# EAGLE design power electronicsV5.1 (EAGLE 9.6.2)

## Sheet 1 of 2
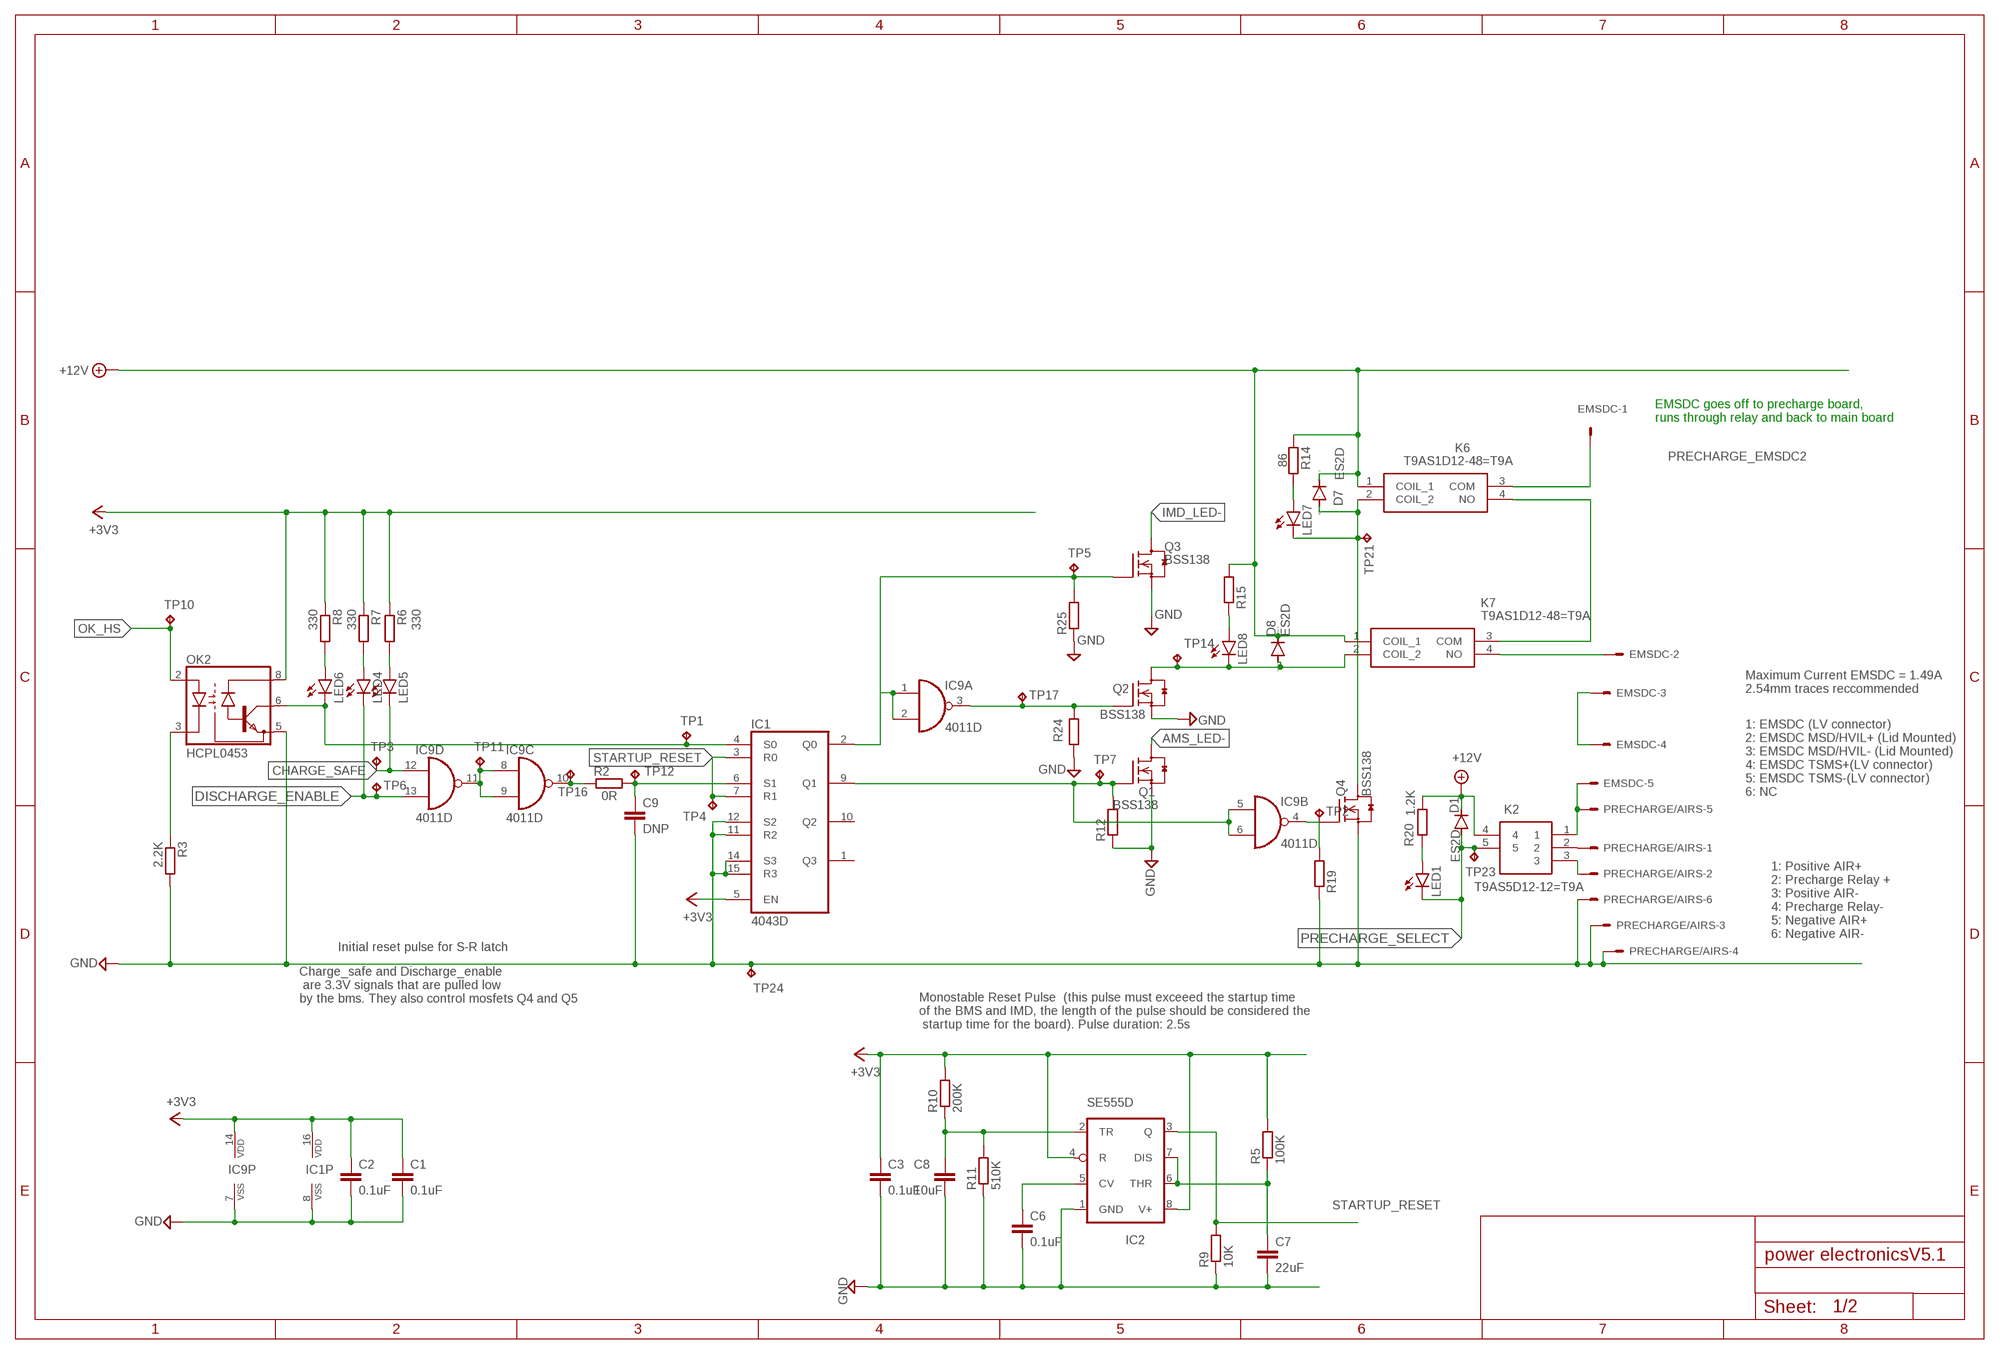
[diagram p0: schematic, sheet 1]

### Parts
C1  0.1uF  C-EUC0805  [C0805]
C2  0.1uF  C-EUC0805  [C0805]
C3  0.1uF  C-EUC0805  [C0805]
C6  0.1uF  C-EUC0805  [C0805]
C7  22uF  C-EUC1206  [C1206]
C8  10uF  C-EUC0805  [C0805]
C9  DNP  C-EUC0805K  [C0805K]
D1  ES2D  [SMB]
D7  ES2D  [SMB]
D8  ES2D  [SMB]
EMSDC  KK-156-6  [KK-156-6]
IC1  4043D  [SO16]
IC2  SE555D  [SO08]
IC9  4011D  [SO14]
K2  T9AS5D12-12=T9A  [T9AS1D12]
K6  T9AS1D12-48=T9A  [T9AS1D1248T9A]
K7  T9AS1D12-48=T9A  [T9AS1D1248T9A]
LED1  LEDSML0805  [SML0805]
LED4  LEDSML0805  [SML0805]
LED5  LEDSML0805  [SML0805]
LED6  LEDSML0805  [SML0805]
LED7  LEDSML0805  [SML0805]
LED8  LEDSML0805  [SML0805]
OK2  HCPL0453  [SOIC08]
PRECHARGE/AIRS  KK-156-6  [KK-156-6]
Q1  BSS138  [SOT23]
Q2  BSS138  [SOT23]
Q3  BSS138  [SOT23]
Q4  BSS138  [SOT23]
R2  0R  R-EU_R0805  [R0805]
R3  2.2K  R-EU_R0805  [R0805]
R5  100K  R-EU_R0805  [R0805]
R6  330  R-EU_R0805  [R0805]
R7  330  R-EU_R0805  [R0805]
R8  330  R-EU_R0805  [R0805]
R9  10K  R-EU_R0805  [R0805]
R10  200K  R-EU_R0805  [R0805]
R11  510K  R-EU_R0805  [R0805]
R12  R-EU_R0805  [R0805]
R14  R-EU_R0805  [R0805]
R15  R-EU_R0805  [R0805]
R19  R-EU_R0805  [R0805]
R20  1.2K  R-EU_R0805  [R0805]
R24  R-EU_R0805  [R0805]
R25  R-EU_R0805  [R0805]
TP1  TPPAD1-17  [P1-17]
TP2  TPPAD1-17  [P1-17]
TP3  TPPAD1-17  [P1-17]
TP4  TPPAD1-17  [P1-17]
TP5  TPPAD1-17  [P1-17]
TP6  TPPAD1-17  [P1-17]
TP7  TPPAD1-17  [P1-17]
TP10  TPPAD1-17  [P1-17]
TP11  TPPAD1-17  [P1-17]
TP12  TPPAD1-17  [P1-17]
TP14  TPPAD1-17  [P1-17]
TP16  TPPAD1-17  [P1-17]
TP17  TPPAD1-17  [P1-17]
TP21  TPPAD1-17  [P1-17]
TP23  TPPAD1-17  [P1-17]
TP24  TPPAD1-17  [P1-17]

### Nets
+3V3: C1.1 C2.1 C3.1 IC1.5(EN) IC1.16(VDD) IC2.4(R) IC2.8(V+) IC9.14(P:VDD) OK2.8(VCC) R5.2 R6.1 R7.1 R8.1 R10.2
+12V [power]: D1.C D7.C D8.C K2.4 K6.1(COIL_1) K7.1(COIL_1) R14.2 R15.2 R20.1 ; also sheet 2
AMS_LED-: Q1.3(D) ; also sheet 2
CHARGE_SAFE: IC9.12(D:I0) LED5.C TP3.TP ; also sheet 2
DISCHARGE_ENABLE: IC1.9(Q1) IC9.5(B:I0) IC9.6(B:I1) IC9.13(D:I1) LED4.C Q1.1(G) R12.2 TP6.TP TP7.TP ; also sheet 2
GND [GND]: C1.2 C2.2 C3.2 C6.2 C7.2 C8.2 C9.2 IC1.8(VSS) IC1.11(R2) IC1.12(S2) IC1.14(S3) IC1.15(R3) IC2.1(GND) IC9.7(P:VSS) OK2.5(GND) PRECHARGE/AIRS.3 PRECHARGE/AIRS.4 PRECHARGE/AIRS.6 Q1.2(S) Q2.2(S) Q3.2(S) Q4.2(S) R3.2 R9.1 R11.1 R12.1 R19.1 R24.1 R25.1 TP24.TP ; also sheet 2
IMD_COIL_OUT: D8.A K7.2(COIL_2) LED8.C Q2.3(D) TP14.TP
IMD_LED-: Q3.3(D) ; also sheet 2
N$1: IC9.10(C:O) R2.1 TP16.TP
N$3 [EMSDC]: K2.2 PRECHARGE/AIRS.1
N$5: IC1.4(S0) LED6.C OK2.6(VO) TP1.TP
N$6: IC9.8(C:I0) IC9.9(C:I1) IC9.11(D:O) TP11.TP
N$7: OK2.3(C) R3.1
N$8: IC9.3(A:O) Q2.1(G) R24.2 TP17.TP
N$9: IC1.2(Q0) IC9.1(A:I0) IC9.2(A:I1) Q3.1(G) R25.2 TP5.TP
N$10: C9.1 IC1.6(S1) R2.2 TP12.TP
N$11 [EMSDC]: EMSDC.5 K2.1 PRECHARGE/AIRS.5
N$12 [EMSDC]: K2.3 PRECHARGE/AIRS.2
N$14: EMSDC.2 K7.4(NO)
N$15 [GND]: D7.A K6.2(COIL_2) LED7.C Q4.3(D) TP21.TP
N$16: IC9.4(B:O) Q4.1(G) R19.2 TP2.TP
N$17: C7.1 IC2.6(THR) IC2.7(DIS) R5.1
N$18: LED7.A R14.1
N$19 [EMSDC]: EMSDC.3 EMSDC.4
N$20: LED8.A R15.1
N$21 [GND]: K6.4(NO) K7.3(COM)
N$22: LED1.A R20.2
N$25: LED4.A R7.2
N$26: LED5.A R6.2
N$27: LED6.A R8.2
N$28: C8.1 IC2.2(TR) R10.1 R11.2
N$32: C6.1 IC2.5(CV)
OK_HS: OK2.2(A) TP10.TP ; also sheet 2
PRECHARGE_EMSDC2: EMSDC.1 K6.3(COM)
PRECHARGE_SELECT: D1.A K2.5 LED1.C TP23.TP ; also sheet 2
STARTUP_RESET: IC1.3(R0) IC1.7(R1) IC2.3(Q) R9.2 TP4.TP
Unconnected: EMSDC.6 IC1.1(Q3) IC1.10(Q2)

### Notes on the sheet
- EMSDC goes off to precharge board, 
  runs through relay and back to main board
- Maximum Current EMSDC = 1.49A
  2.54mm traces reccommended
- 1: EMSDC (LV connector)
  2: EMSDC MSD/HVIL+ (Lid Mounted)
  3: EMSDC MSD/HVIL- (Lid Mounted)
  4: EMSDC TSMS+(LV connector)
  5: EMSDC TSMS-(LV connector)
  6: NC
- 1: Positive AIR+
  2: Precharge Relay +
  3: Positive AIR-
  4: Precharge Relay-
  5: Negative AIR+
  6: Negative AIR-
- Initial reset pulse for S-R latch
- Charge_safe and Discharge_enable
   are 3.3V signals that are pulled low 
  by the bms. They also control mosfets Q4 and Q5
- Monostable Reset Pulse  (this pulse must exceeed the startup time 
  of the BMS and IMD, the length of the pulse should be considered the
   startup time for the board). Pulse duration: 2.5s

## Sheet 2 of 2
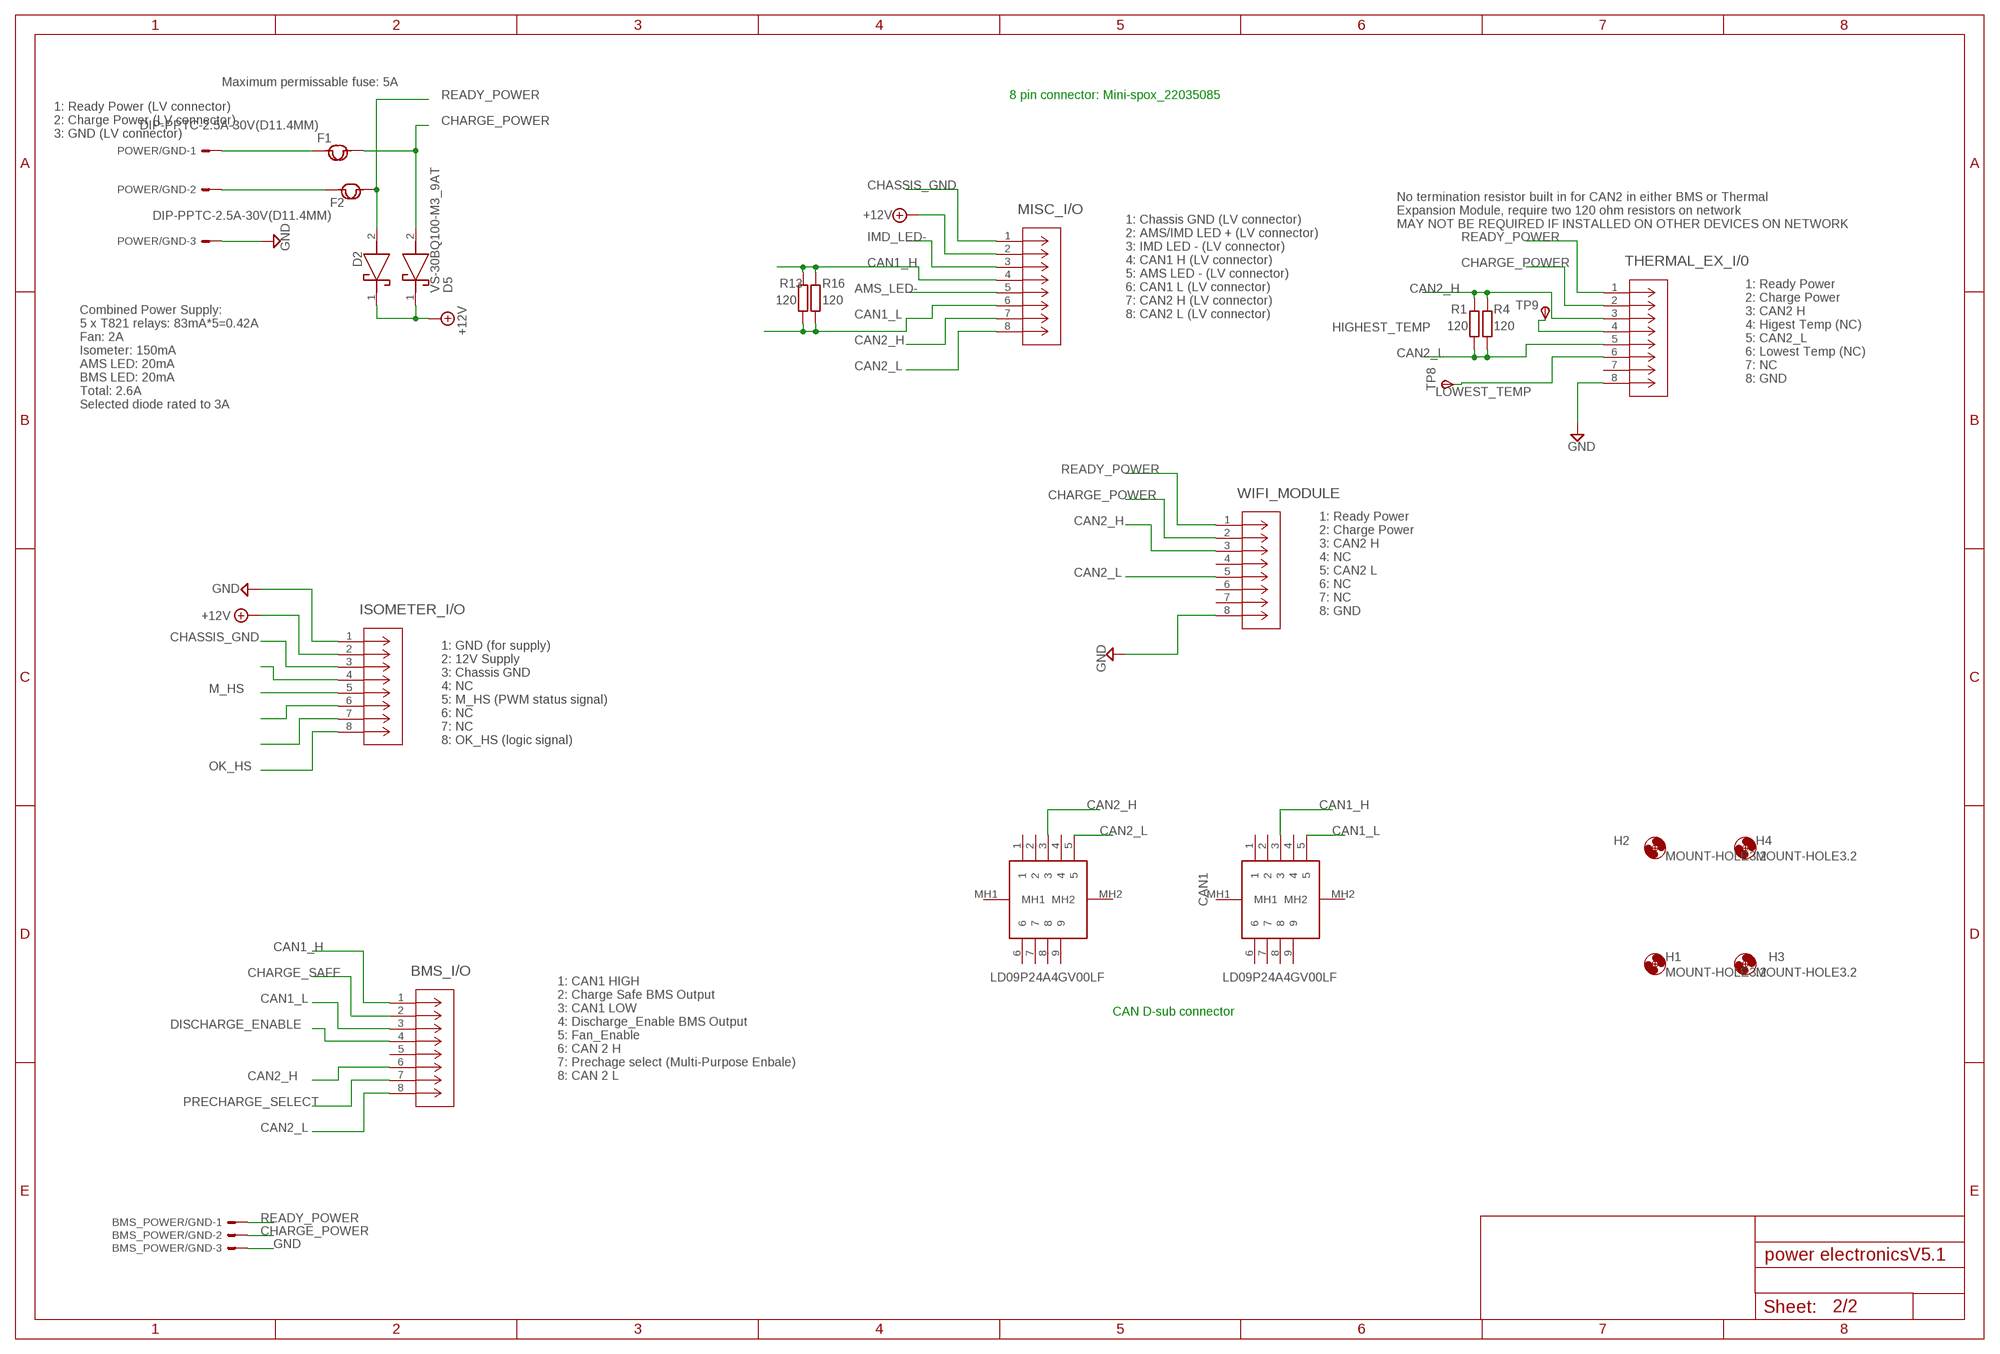
[diagram p1: schematic, sheet 2]

### Parts
BMS_I/O  MINI-SPOX_22035085  [CON_22035085_MOL]
BMS_POWER/GND  KK-156-3  [KK-156-3]
CAN1  LD09P24A4GV00LF  [LD09P24A4GV00LF]
CAN2  LD09P24A4GV00LF  [LD09P24A4GV00LF]
D2  VS-30BQ100-M3_9AT  [DIOM7959X262N]
D5  VS-30BQ100-M3_9AT  [DIOM7959X262N]
F1  DIP-PPTC-2.5A-30V(D11.4MM)  [F2-5.1-11.4X3.0X18.3MM]
F2  DIP-PPTC-2.5A-30V(D11.4MM)  [F2-5.1-11.4X3.0X18.3MM]
H1  MOUNT-HOLE3.2  [3,2]
H2  MOUNT-HOLE3.2  [3,2]
H3  MOUNT-HOLE3.2  [3,2]
H4  MOUNT-HOLE3.2  [3,2]
ISOMETER_I/O  MINI-SPOX_22035085  [CON_22035085_MOL]
MISC_I/O  MINI-SPOX_22035085  [CON_22035085_MOL]
POWER/GND  KK-156-3  [KK-156-3]
R1  120  R-EU_R1206  [R1206]
R4  120  R-EU_R1206  [R1206]
R13  120  R-EU_R1206  [R1206]
R16  120  R-EU_R1206  [R1206]
THERMAL_EX_I/0  MINI-SPOX_22035085  [CON_22035085_MOL]
TP8  TPSTP11R  [TP11R]
TP9  TPSTP11R  [TP11R]
WIFI_MODULE  MINI-SPOX_22035085  [CON_22035085_MOL]

### Nets
+12V [power]: D2.1(K) D5.1(K) ISOMETER_I/O.2 MISC_I/O.2 ; also sheet 1
AMS_LED-: MISC_I/O.5 ; also sheet 1
CAN1_H: BMS_I/O.1 CAN1.3 MISC_I/O.4 R13.1 R16.1
CAN1_L: BMS_I/O.3 CAN1.5 MISC_I/O.6 R13.2 R16.2
CAN2_H: BMS_I/O.6 CAN2.3 MISC_I/O.7 R1.1 R4.1 THERMAL_EX_I/0.3 WIFI_MODULE.3
CAN2_L: BMS_I/O.8 CAN2.5 MISC_I/O.8 R1.2 R4.2 THERMAL_EX_I/0.5 WIFI_MODULE.5
CHARGE_POWER [power]: BMS_POWER/GND.2 D5.2(A) F1.1 THERMAL_EX_I/0.2 WIFI_MODULE.2
CHARGE_SAFE: BMS_I/O.2 ; also sheet 1
CHASSIS_GND [GND]: ISOMETER_I/O.3 MISC_I/O.1
DISCHARGE_ENABLE: BMS_I/O.4 ; also sheet 1
GND [GND]: BMS_POWER/GND.3 ISOMETER_I/O.1 POWER/GND.3 THERMAL_EX_I/0.8 WIFI_MODULE.8 ; also sheet 1
HIGHEST_TEMP: THERMAL_EX_I/0.4 TP9.TP(PP)
IMD_LED-: MISC_I/O.3 ; also sheet 1
LOWEST_TEMP: THERMAL_EX_I/0.6 TP8.TP(PP)
M_HS: ISOMETER_I/O.5
N$2 [power]: F2.2 POWER/GND.2
N$4 [power]: F1.2 POWER/GND.1
N$46: ISOMETER_I/O.4
N$51: ISOMETER_I/O.7
N$52: ISOMETER_I/O.6
OK_HS: ISOMETER_I/O.8 ; also sheet 1
PRECHARGE_SELECT: BMS_I/O.7 ; also sheet 1
READY_POWER [power]: BMS_POWER/GND.1 D2.2(A) F2.1 THERMAL_EX_I/0.1 WIFI_MODULE.1
Unconnected: BMS_I/O.5 CAN1.1 CAN1.2 CAN1.4 CAN1.6 CAN1.7 CAN1.8 CAN1.9 CAN1.MH1 CAN1.MH2 CAN2.1 CAN2.2 CAN2.4 CAN2.6 CAN2.7 CAN2.8 CAN2.9 CAN2.MH1 CAN2.MH2 THERMAL_EX_I/0.7 WIFI_MODULE.4 WIFI_MODULE.6 WIFI_MODULE.7

### Notes on the sheet
- Maximum permissable fuse: 5A
- 8 pin connector: Mini-spox_22035085
- 1: Ready Power (LV connector)
  2: Charge Power (LV connector)
  3: GND (LV connector)
- No termination resistor built in for CAN2 in either BMS or Thermal
  Expansion Module, require two 120 ohm resistors on network
  MAY NOT BE REQUIRED IF INSTALLED ON OTHER DEVICES ON NETWORK
- 1: Chassis GND (LV connector)
  2: AMS/IMD LED + (LV connector)
  3: IMD LED - (LV connector)
  4: CAN1 H (LV connector)
  5: AMS LED - (LV connector)
  6: CAN1 L (LV connector)
  7: CAN2 H (LV connector)
  8: CAN2 L (LV connector)
- 1: Ready Power
  2: Charge Power
  3: CAN2 H
  4: Higest Temp (NC)
  5: CAN2_L
  6: Lowest Temp (NC)
  7: NC
  8: GND
- Combined Power Supply:
  5 x T821 relays: 83mA*5=0.42A
  Fan: 2A
  Isometer: 150mA
  AMS LED: 20mA
  BMS LED: 20mA
  Total: 2.6A
  Selected diode rated to 3A
- 1: Ready Power
  2: Charge Power
  3: CAN2 H
  4: NC
  5: CAN2 L
  6: NC
  7: NC
  8: GND
- 1: GND (for supply) 
  2: 12V Supply
  3: Chassis GND 
  4: NC 
  5: M_HS (PWM status signal)
  6: NC
  7: NC
  8: OK_HS (logic signal)
- CAN D-sub connector
- 1: CAN1 HIGH
  2: Charge Safe BMS Output 
  3: CAN1 LOW
  4: Discharge_Enable BMS Output
  5: Fan_Enable
  6: CAN 2 H
  7: Prechage select (Multi-Purpose Enbale)
  8: CAN 2 L

## Library data of the parts
BMS_I/O ISOMETER_I/O MISC_I/O THERMAL_EX_I/0 WIFI_MODULE = Mini-spox_22035085:MINI-SPOX_22035085; COPYRIGHT: Copyright (C) 2023 Ultra Librarian. All rights reserved.; MANUFACTURER_PART_NUMBER: 22035085; MFR_NAME: Molex Connector Corporation
BMS_POWER/GND POWER/GND = con-molex:KK-156-3: KK 156 HEADER Source: http://www.molex.com/pdm_docs/sd/026604100_sd.pdf; MF: MOLEX; OC_FARNELL: unknown; OC_NEWARK: unknown
C1-C3 C6-C9 = rcl:C-EU: CAPACITOR, European symbol; SPICEPREFIX: C
CAN1 CAN2 = LD09P24A4GV00LF:LD09P24A4GV00LF: Amphenol FCI LD Series, 9 Way Plug-In Mount D-sub Connector Plug, 2.74mm Pitch, with Screw Source: Datasheet <https://www.mouser.com/datasheet/2/18/10130912-1362365.pdf>; ARROW_PART_NUMBER: LD09P24A4GV00LF; ARROW_PRICE-STOCK: https://www.arrow.com/en/products/ld09p24a4gv00lf/amphenol-fci?region=nac; DESCRIPTION: Amphenol FCI LD Series, 9 Way Plug-In Mount D-sub Connector Plug, 2.74mm Pitch, with Screw; HEIGHT: 12.15mm; MANUFACTURER_NAME: Amphenol Communication Solutions; MANUFACTURER_PART_NUMBER: LD09P24A4GV00LF; MOUSER_PART_NUMBER: 649-LD09P24A4GV00LF; MOUSER_PRICE-STOCK: https://www.mouser.co.uk/ProductDetail/Amphenol-FCI/LD09P24A4GV00LF?qs=tZOhSuJQg1nfkziarphghA%3D%3D
D1 D7 D8 = diode:ES2D: DIODE super fast rectifier, 2 A
D2 D5 = SamacSys_Parts:VS-30BQ100-M3_9AT: Vishay VS-30BQ100-M3/9AT SMT Schottky Diode, 100V 3A, 2-Pin DO-214AB Source: Datasheet <https://componentsearchengine.com/Datasheets/1/VS-30BQ100-M3_9AT.pdf>; DESCRIPTION: Vishay VS-30BQ100-M3/9AT SMT Schottky Diode, 100V 3A, 2-Pin DO-214AB; HEIGHT: 2.62mm; MANUFACTURER_NAME: Vishay; MANUFACTURER_PART_NUMBER: VS-30BQ100-M3/9AT; MOUSER_PART_NUMBER: 78-VS-30BQ100-M39AT; MOUSER_PRICE-STOCK: https://www.mouser.com/Search/Refine.aspx?Keyword=78-VS-30BQ100-M39AT
EMSDC PRECHARGE/AIRS = con-molex:KK-156-6: KK 156 HEADER Source: http://www.molex.com/pdm_docs/sd/026604100_sd.pdf; MF: MOLEX; OC_FARNELL: unknown; OC_NEWARK: unknown
F1 F2 = DIP-PPTC-2.5A-30V_D11.4MM_:DIP-PPTC-2.5A-30V(D11.4MM): 307010009 Check availability <https://pricing.snapeda.com/parts/30R250/Littelfuse/view-part?ref=eda>; AVAILABILITY: In Stock; DESCRIPTION: Polymeric PTC Resettable Fuse 30V 2.5A Ih Through Hole Radial, Disc; MF: Littelfuse; MP: 30R250; PACKAGE: Radial Littelfuse Inc.; PRICE: None
H1-H4 = holes:MOUNT-HOLE: MOUNTING HOLE with drill center marker
IC1 = 40xx:4043: Quad 3-state NOR R/S LATCH
IC2 = linear:*555: TIMER
IC9 = 40xx:4011: Quad 2-input NAND
K2 = SamacSys_Parts:T9AS5D12-12=T9A: PCB Relay SPDT 30A 12Vdc,thru hole SPDT PCB Mount Non-Latching Relay Through Hole, 12V dc Source: Datasheet; ALLIED_NUMBER: R1111589; DESCRIPTION: PCB Relay SPDT 30A 12Vdc,thru hole SPDT PCB Mount Non-Latching Relay Through Hole, 12V dc; HEIGHT: mm; MANUFACTURER_NAME: TE Connectivity; MANUFACTURER_PART_NUMBER: T9AS5D12-12=T9A; RS_PART_NUMBER: 6802528; RS_PRICE-STOCK: https://uk.rs-online.com/web/p/products/6802528
K6 K7 = T9AS1D12-12=T9A:T9AS1D12-48=T9A: SPST-NO PCB Mount Non-Latching Relay Through Hole, 48V dc Source: Datasheet <https://www.te.com/commerce/DocumentDelivery/DDEController?Action=showdoc&DocId=Data Sheet1308242_T9A0915pdfEnglishENG_DS_1308242_T9A_0915.pdf1-1393210-9>; DESCRIPTION: SPST-NO PCB Mount Non-Latching Relay Through Hole, 48V dc; HEIGHT: 20.4mm; MANUFACTURER_NAME: TE Connectivity; MANUFACTURER_PART_NUMBER: T9AS1D12-48=T9A
LED1 LED4-LED8 = led:LED: LED OSRAM: - CHIPLED LG R971, LG N971, LY N971, LG Q971, LY Q971, LO R971, LY R971 LH N974, LH R974 LS Q976, LO Q976, LY Q976 LO Q996 - Hyper CHIPLED LW Q18S LB Q993, LB Q99A, LB R99A - SideLED LS A670, LO A670, LY A670, LG A670, LP A670 LB A673, LV A673, LT A673, LW A673 LH A674 LY A675 LS A676, LA A676, LO A676, LY A676, LW A676 LS A679, LY A679, LG A679 - Hyper Micro SIDELED® LS Y876, LA Y876, LO Y876, LY Y876 LT Y87S - SmartLED LW L88C, LW L88S LB L89C, LB L89S, LG L890 LS L89K, LO L89K, LY L89K LS L896, LA L896, LO L896, LY L896 - TOPLED LS T670, LO T670, LY T670, LG T670, LP T670 LSG T670, LSP T670, LSY T670, LOP T670, LYG T670 LG T671, LOG T671, LSG T671 LB T673, LV T673, LT T673, LW T673 LH T674 LS T676, LA T676, LO T676, LY T676, LB T676, LH T676, LSB T676, LW T676 LB T67C, LV T67C, LT T67C, LS T67K, LO T67K, LY T67K, LW E67C LS E67B, LA E67B, LO E67B, LY E67B, LB E67C, LV E67C, LT E67C LW T67C LS T679, LY T679, LG T679 LS T770, LO T770, LY T770, LG T770, LP T770 LB T773, LV T773, LT T773, LW T773 LH T774 LS E675, LA E675, LY E675, LS T675 LS T776, LA T776, LO T776, LY T776, LB T776 LHGB T686 LT T68C, LB T68C - Hyper Mini TOPLED® LB M676 - Mini TOPLED Santana® LG M470 LS M47K, LO M47K, LY M47K Source: http://www.osram.convergy.de LUXEON: - LUMILED® LXK2-PW12-R00, LXK2-PW12-S00, LXK2-PW14-U00, LXK2-PW14-V00 LXK2-PM12-R00, LXK2-PM12-S00, LXK2-PM14-U00 LXK2-PE12-Q00, LXK2-PE12-R00, LXK2-PE12-S00, LXK2-PE14-T00, LXK2-PE14-U00 LXK2-PB12-K00, LXK2-PB12-L00, LXK2-PB12-M00, LXK2-PB14-N00, LXK2-PB14-P00, LXK2-PB14-Q00 LXK2-PR12-L00, LXK2-PR12-M00, LXK2-PR14-Q00, LXK2-PR14-R00 LXK2-PD12-Q00, LXK2-PD12-R00, LXK2-PD12-S00 LXK2-PH12-R00, LXK2-PH12-S00 LXK2-PL12-P00, LXK2-PL12-Q00, LXK2-PL12-R00 Source: www.luxeon.com KINGBRIGHT: KA-3528ASYC Source: www.kingbright.com
OK2 = optocoupler:HCPL0453: HEWLETT PACKARD OPTO COUPLER; MF: AGILENT TECHNOLOGIES; MPN: HCPL-0453-000E; OC_FARNELL: 1505123; OC_NEWARK: 88H7766
Q1-Q4 = m-pad-2.1:BSS138: Fairchild Semiconductors BSS138 N-Channel Logic Level Enhancement Mode Field Effect Transistor General Description: These N-Channel enhancement mode field effect transistors are produced using Fairchild's proprietary, high cell density, DMOS technology. These products have been designed to minimize on-state resistance while provide rugged, reliable, and fast switching performance.These products are particularly suited for low voltage, low current applications such as small servo motor control, power MOSFET gate drivers, and other switching applications. Features: 0.22 A, 50 V. RDS(ON) = 3.5Ohm @ VGS = 10 V RDS(ON) = 6.0Ohm @ VGS = 4.5 V High density cell design for extremely low RDS(ON) Rugged and Reliable Compact industry standard SOT-23 surface mount package Please send any comments to: messi@users.sourceforge.net
R1-R16 R19 R20 R24 R25 = rcl:R-EU_: RESISTOR, European symbol; SPICEPREFIX: R
TP1-TP7 TP10-TP12 TP14 TP16 TP17 TP21 TP23 TP24 = testpad:TP: Test pad
TP8 TP9 = testpad:TPS: TEST PIN

## Net classes
0 default: width 0.508 mm
1 GND: width 0.889 mm
2 EMSDC: width 2.54 mm
3 power: width 0.889 mm

## Board
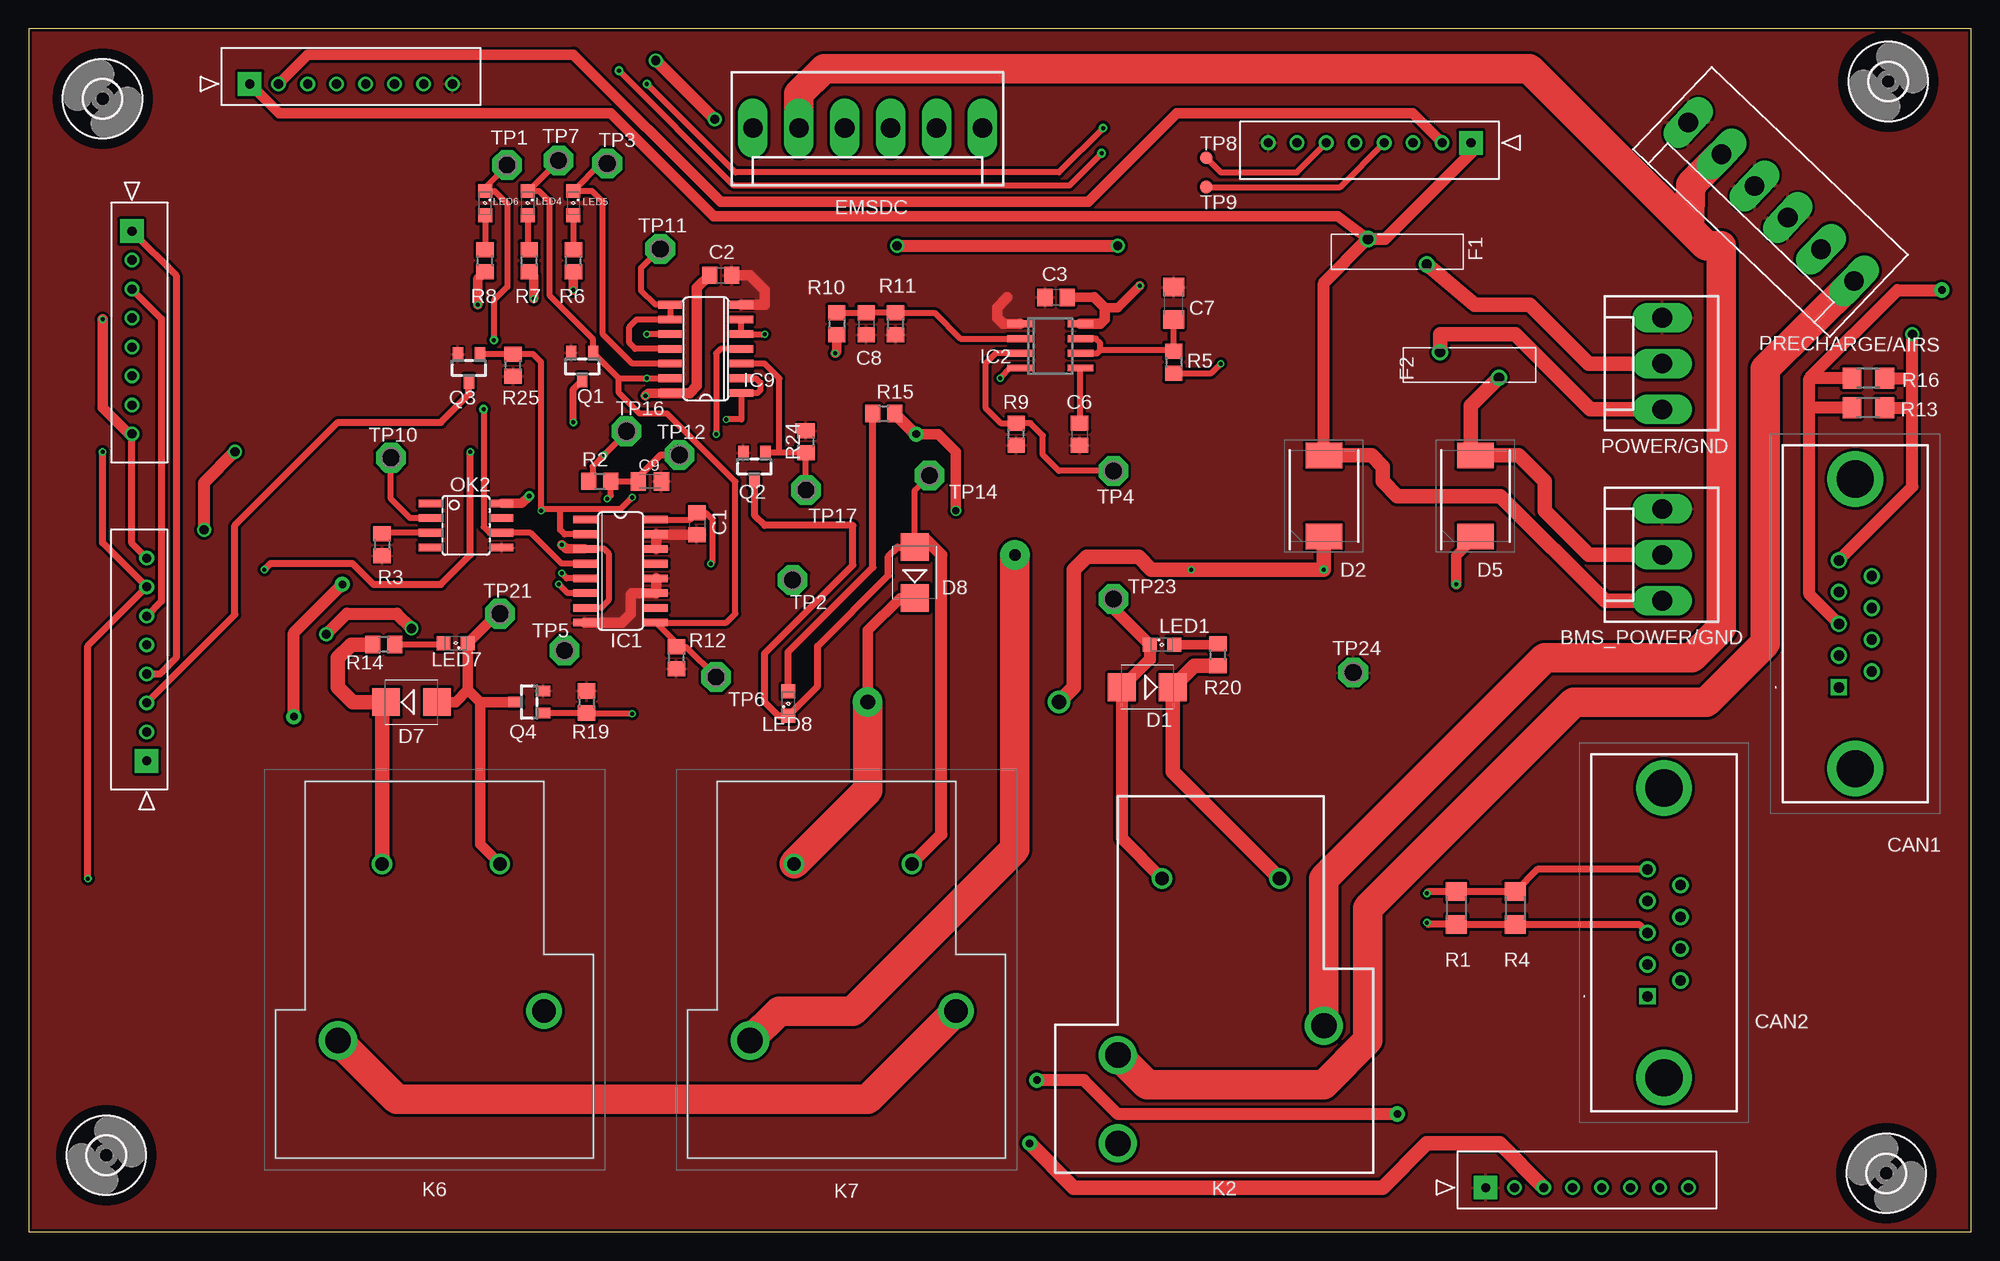
[diagram p2: board, top side]
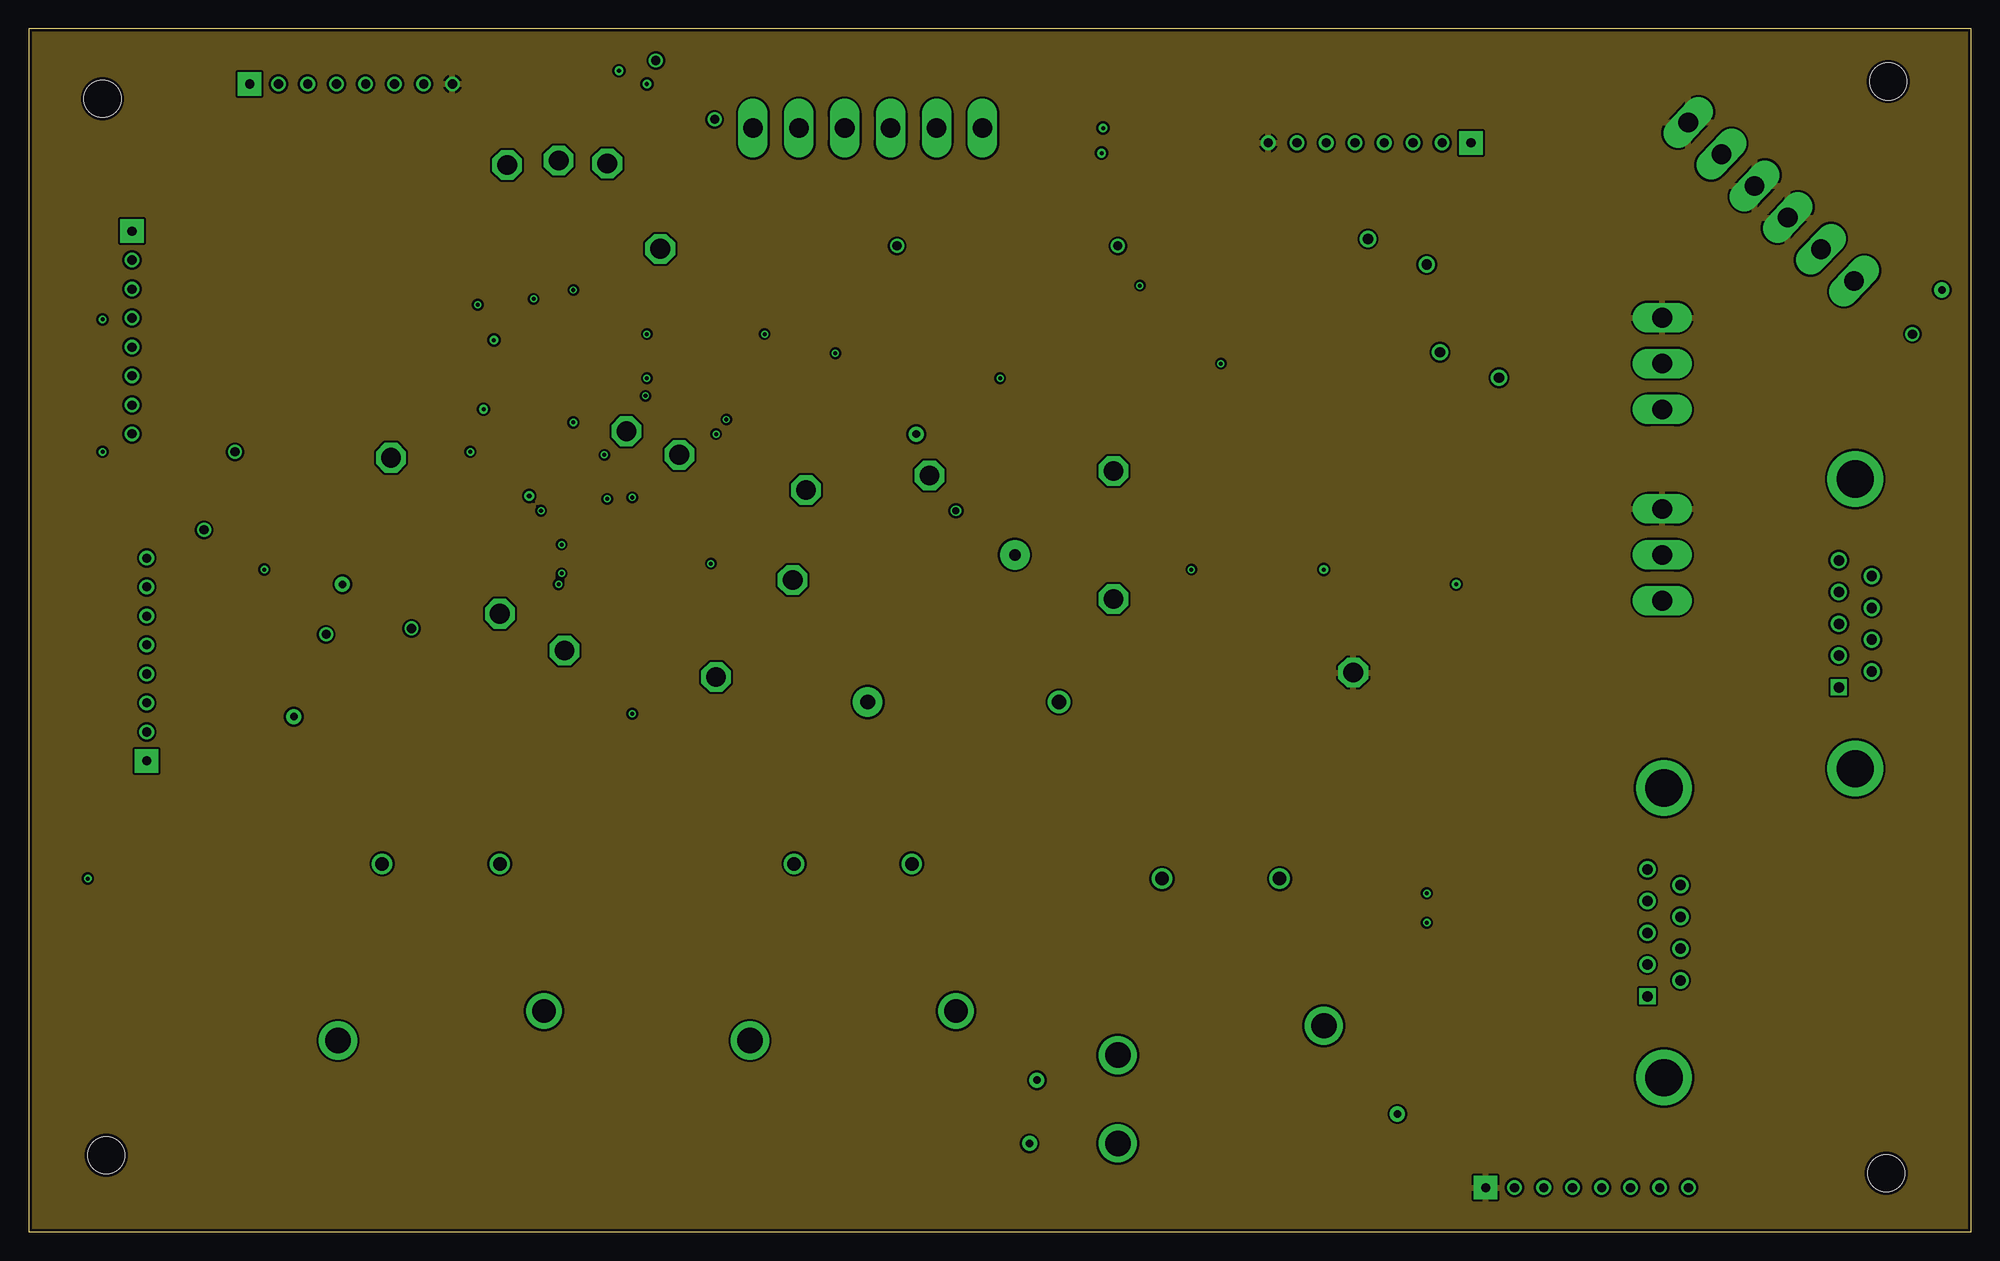
[diagram p3: board, inner layer Route2]
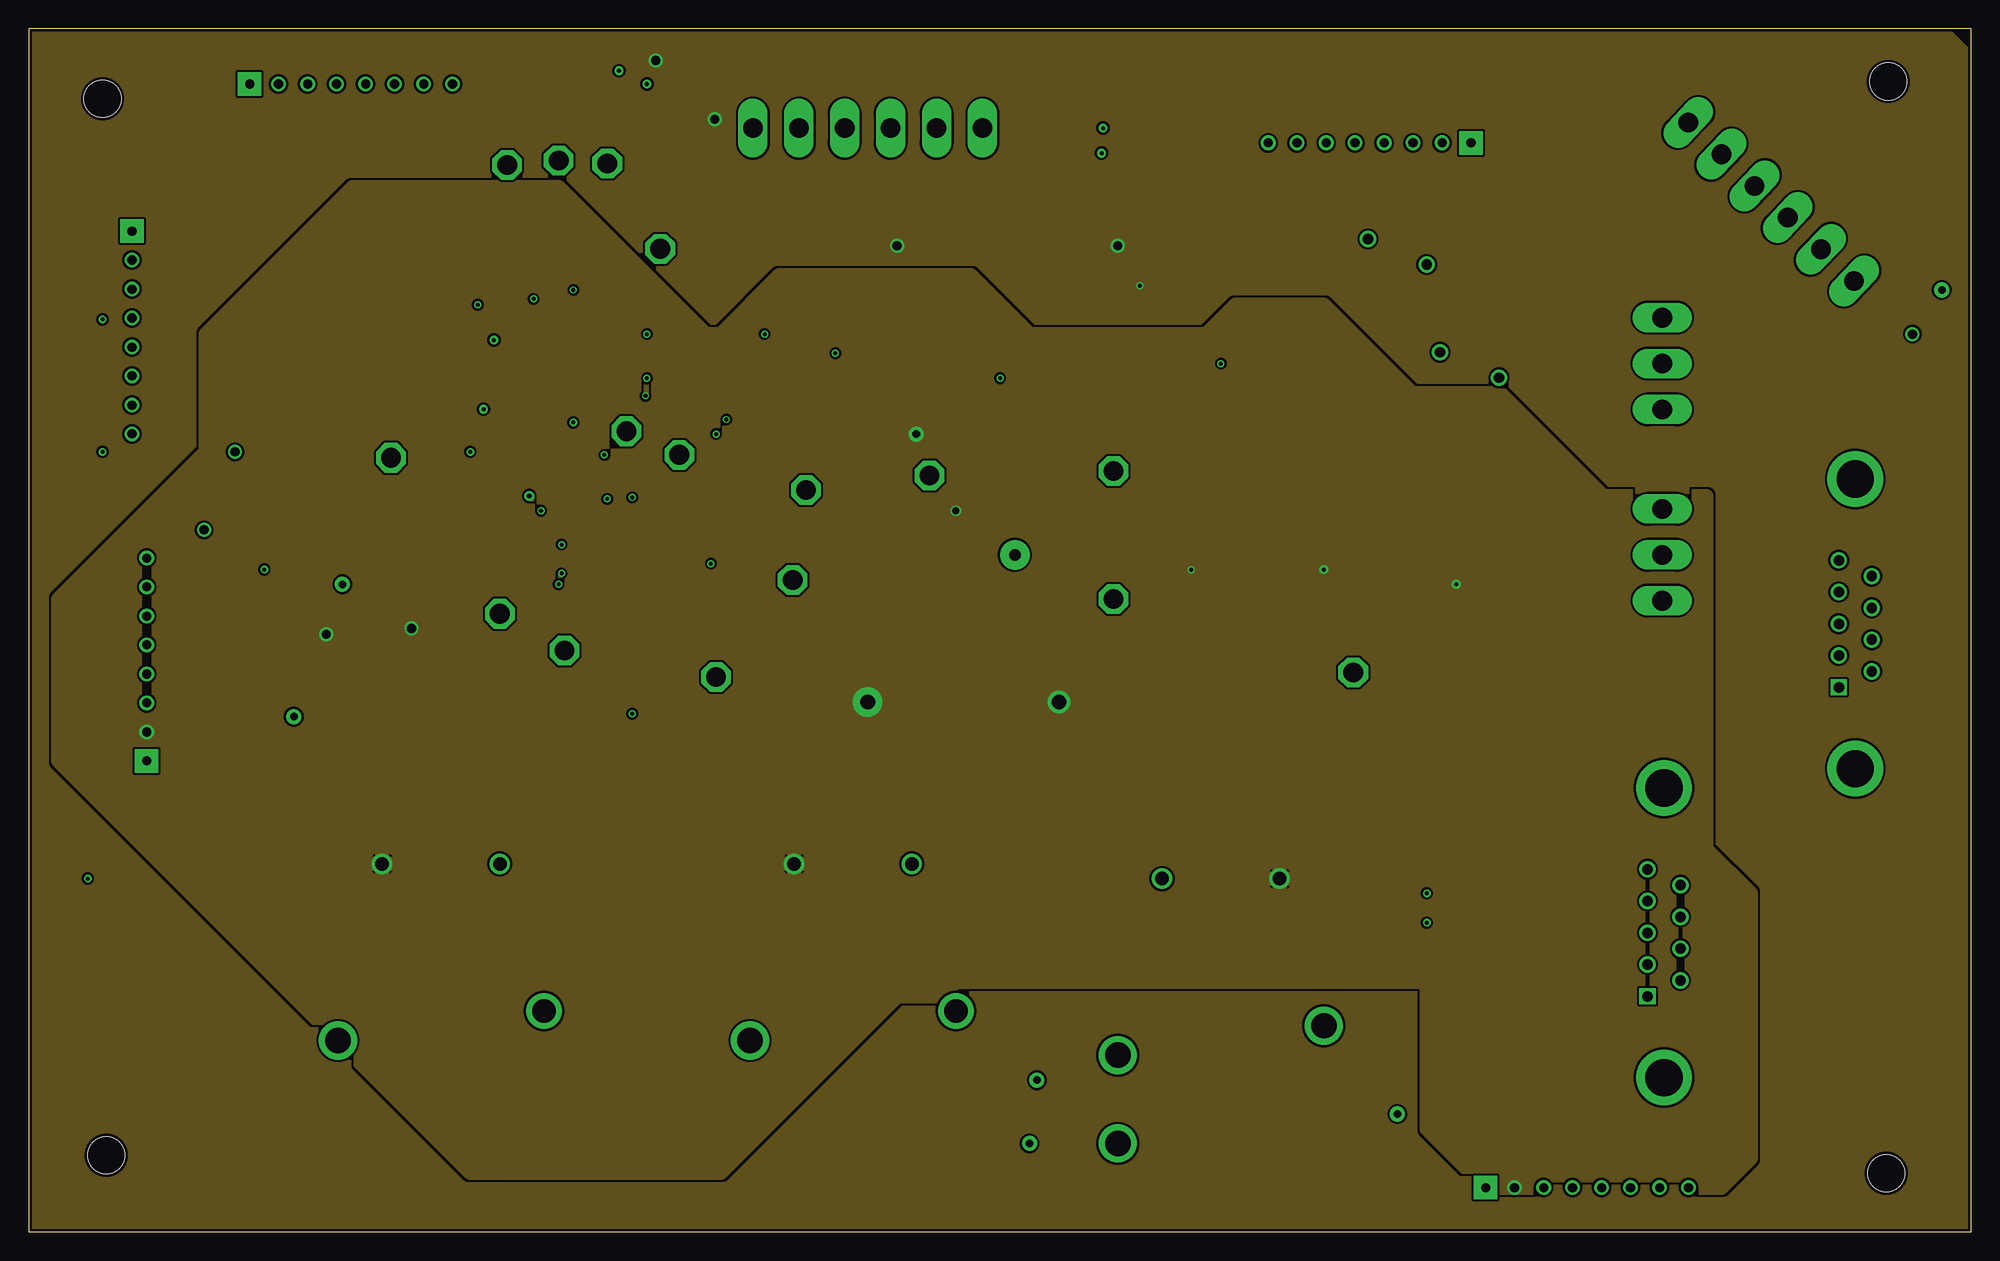
[diagram p4: board, inner layer Route15]
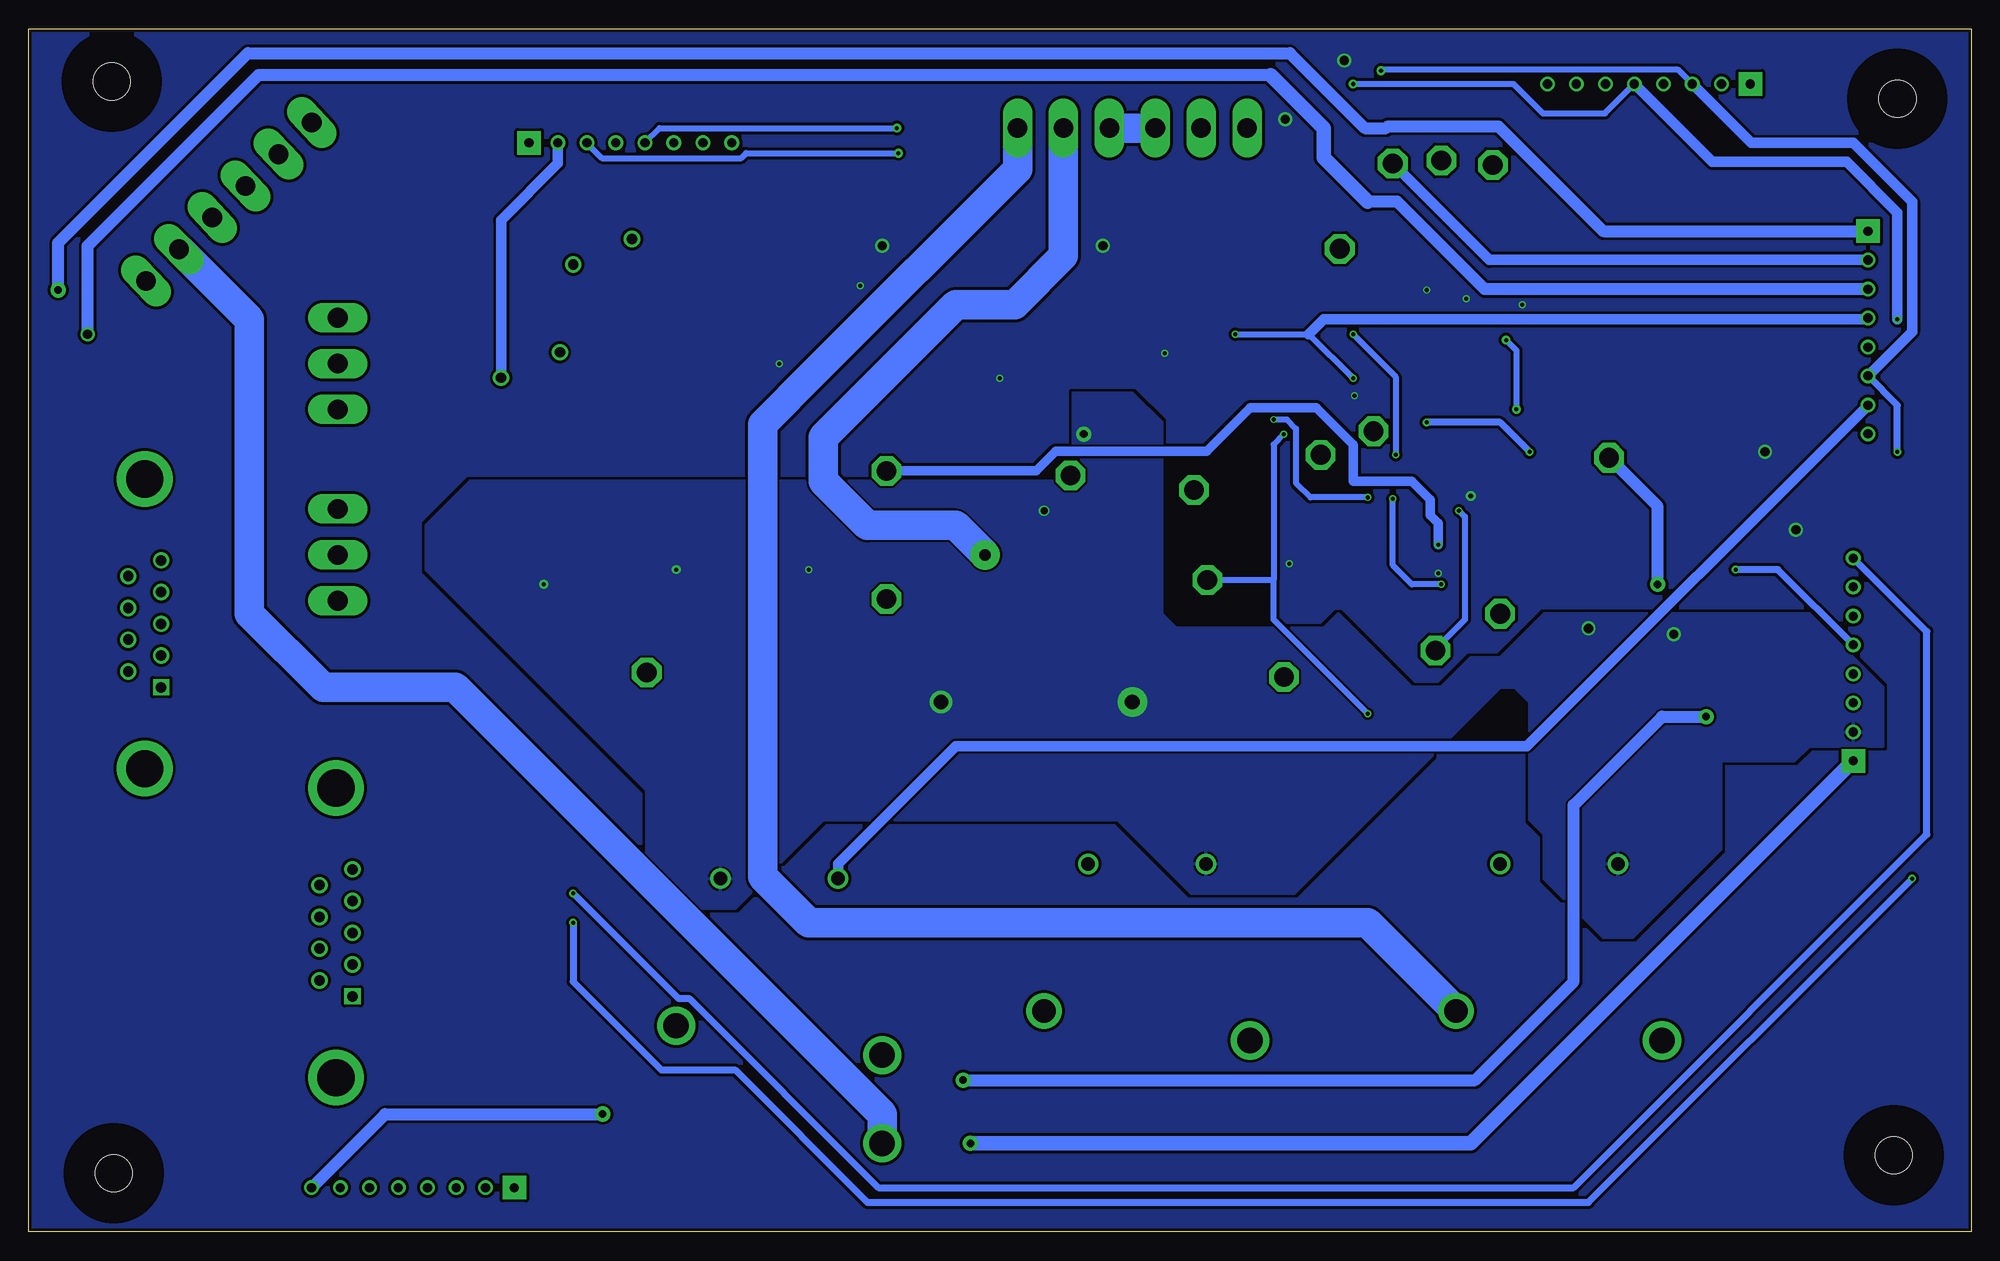
[diagram p5: board, bottom side, seen from below]

Size 167.62 x 103.81 mm. Coordinates in mm from the lower left corner, seen from the top.
Outline: 0,0 167.62,0 167.62,103.81 0,103.81 0,0
Copper layers (1*16): Top 0.018mm / dielectric 1.55mm / Bottom 0.018mm
Design rules "eC_2Layer_PClass6_BaseCopperO18_eCDefault *": minimum track width 0.15mm, minimum drill 0.35mm, track to track 0.2mm, track to pad 0.2mm, pad to pad 0.2mm, via to via 0.2mm, smd to smd 0mil, copper to edge 0.25mm, drill to drill 0.35mm, minimum pad ring 0.175mm, minimum via ring 0.125mm, stop-mask expansion 0mil, vias tented up to drill 0.45mm, thermal gap 0.2mm

### Footprints (pad centres in the part's own frame; a part is rotated, then mirrored left to right if it is on the bottom)
CON_22035085_MOL = drill 0.787 pad 2.032 square: 1 0,0 | drill 0.787 pad 1.27: 2 -2.489,0; 3 -5.004,0; 4 -7.493,0; 5 -10.008,0; 6 -12.497,0; 7 -15.011,0; 8 -17.501,0
KK-156-3 = drill 1.7 pad 2.184 long: 1 -3.96,0; 2 0,0; 3 3.96,0
C0805 = smd 1.3 x 1.5: 1 -0.95,0; 2 0.95,0
C1206 = smd 1.6 x 1.8: 1 -1.4,0; 2 1.4,0
C0805K = smd 1.3 x 1.6: 1 -1,0; 2 1,0
LD09P24A4GV00LF = drill 0.9 pad 1.4 square: 1 0,0 | drill 0.9 pad 1.4: 2 2.74,0; 3 5.48,0; 4 8.22,0; 5 10.96,0; 6 1.37,-2.84; 7 4.11,-2.84; 8 6.85,-2.84; 9 9.59,-2.84 | drill 3.2 pad 4.8: MH1 -7.015,-1.42; MH2 17.975,-1.42
SMB = smd 2.4 x 2.4: A 2.2,0; C -2.2,0
DIOM7959X262N = smd 2.2 x 3.15: 1 -3.5,0; 2 3.5,0
KK-156-6 = drill 1.7 pad 2.184 long: 1 -9.9,0; 2 -5.94,0; 3 -1.98,0; 4 1.98,0; 5 5.94,0; 6 9.9,0
F2-5.1-11.4X3.0X18.3MM = drill 0.889 pad 1.397: 1 -2.54,1.1; 2 2.54,-1.1
3,2 = hole 3.2: 0,0
SO16 = smd 0.66 x 2.032: 1 -4.445,-3.073; 2 -3.175,-3.073; 3 -1.905,-3.073; 4 -0.635,-3.073; 5 0.635,-3.073; 6 1.905,-3.073; 7 3.175,-3.073; 8 4.445,-3.073; 9 4.445,3.073; 10 3.175,3.073; 11 1.905,3.073; 12 0.635,3.073; 13 -0.635,3.073; 14 -1.905,3.073; 15 -3.175,3.073; 16 -4.445,3.073
SO08 = smd 0.6 x 2.2: 1 -1.905,-2.6; 2 -0.635,-2.6; 3 0.635,-2.6; 4 1.905,-2.6; 5 1.905,2.6; 6 0.635,2.6; 7 -0.635,2.6; 8 -1.905,2.6
SO14 = smd 0.66 x 2.032: 1 -3.81,-3.073; 2 -2.54,-3.073; 3 -1.27,-3.073; 4 0,-3.073; 5 1.27,-3.073; 6 2.54,-3.073; 7 3.81,-3.073; 8 3.81,3.073; 9 2.54,3.073; 10 1.27,3.073; 11 0,3.073; 12 -1.27,3.073; 13 -2.54,3.073; 14 -3.81,3.073
T9AS1D12 = drill 2.19 pad 3.29: 1 -8.89,12.7; 2 8.89,15.24; 3 8.89,22.86 | drill 1.17 pad 1.77: 4 -5.08,0; 5 5.08,0
T9AS1D1248T9A = drill 1.17 pad 1.755: 1 0,0; 2 -10.16,0 | drill 2.06 pad 3.09: 3 -13.97,12.7 | drill 2.19 pad 3.3: 4 3.81,15.24
SML0805 = smd 1.2 x 1.2: A 1.05,0; C -1.05,0
SOIC08 = smd 0.66 x 2.032: 1 -1.905,-3.073; 2 -0.635,-3.073; 3 0.635,-3.073; 4 1.905,-3.073; 5 1.905,3.073; 6 0.635,3.073; 7 -0.635,3.073; 8 -1.905,3.073
SOT23 = smd 0.9 x 1.2: 1 -0.95,-1.2; 2 0.95,-1.2; 3 0,1.2
R1206 = smd 1.6 x 1.803: 1 -1.422,0; 2 1.422,0
R0805 = smd 1.3 x 1.5: 1 -0.95,0; 2 0.95,0
P1-17 = drill 1.702 pad 2.54 octagon: TP 0,0
TP11R = smd 1.1 x 1.1: TP 0,0

### Placement (x,y rotation side)
BMS_I/O  8.89,86.36 90 top
BMS_POWER/GND  140.97,58.42 90 top
C1  57.66,61.09 270 top
C2  59.69,82.55 0 top
C3  88.65,80.64 180 top
C6  90.68,68.83 270 top
C7  98.81,80.14 90 top
C8  72.26,78.36 270 top
C9  53.59,64.77 0 top
CAN1  156.21,46.99 90 top
CAN2  139.7,20.32 90 top
D1  96.52,46.99 180 top
D2  111.76,63.5 90 top
D5  124.84,63.5 90 top
D7  33.02,45.72 0 top
D8  76.45,56.9 90 top
EMSDC  72.39,95.25 180 top
F1  124.33,74.8 180 top
F2  118.11,84.58 0 top
H1  6.35,97.79 90 top
H2  6.68,6.6 0 top
H3  160.48,99.28 0 top
H4  160.3,5.04 90 top
IC1  51.05,57.02 270 top
IC2  88.14,76.45 270 top
IC9  58.42,76.2 90 top
ISOMETER_I/O  125.73,3.81 180 top
K2  102.87,30.48 180 top
K6  30.48,31.75 180 top
K7  66.04,31.75 180 top
LED1  97.79,50.67 0 top
LED4  43.05,88.77 270 top
LED5  46.99,88.77 270 top
LED6  39.37,88.77 270 top
LED7  36.83,50.8 180 top
LED8  65.53,45.59 90 top
MISC_I/O  10.16,40.64 270 top
OK2  37.72,60.96 270 top
POWER/GND  140.97,74.93 90 top
PRECHARGE/AIRS  150.37,88.9 136.3 top
Q1  47.75,74.68 180 top
Q2  62.61,66.04 180 top
Q3  37.97,74.55 180 top
Q4  43.18,45.72 90 top
R1  123.19,27.94 90 top
R2  49.28,64.77 0 top
R3  30.48,59.31 270 top
R4  128.27,27.94 90 top
R5  98.81,75.06 270 top
R6  46.99,83.82 90 top
R7  43.18,83.82 90 top
R8  39.37,83.82 90 top
R9  85.22,68.83 90 top
R10  69.72,78.36 270 top
R11  74.8,78.36 90 top
R12  55.88,49.53 90 top
R13  158.75,71.12 0 top
R14  30.61,50.67 180 top
R15  73.79,70.61 0 top
R16  158.75,73.66 0 top
R19  48.13,45.72 270 top
R20  102.62,49.78 90 top
R24  67.06,68.2 270 top
R25  41.78,74.8 90 top
THERMAL_EX_I/0  124.46,93.98 0 top
TP1  41.27,92.08 0 top
TP2  65.91,56.26 0 top
TP3  49.91,92.2 0 top
TP4  93.6,65.66 0 top
TP5  46.23,50.16 0 top
TP6  59.31,47.88 0 top
TP7  45.72,92.46 0 top
TP8  101.6,92.71 0 top
TP9  101.6,90.17 0 top
TP10  31.24,66.8 0 top
TP11  54.48,84.84 0 top
TP12  56.13,67.06 0 top
TP14  77.72,65.28 0 top
TP16  51.56,69.09 0 top
TP17  67.06,64.01 0 top
TP21  40.64,53.34 0 top
TP23  93.6,54.61 0 top
TP24  114.3,48.26 0 top
WIFI_MODULE  19.05,99.06 180 top

### Tracks (layer width: path | path; a pad name or v marks a point on that pad's centre or on a via)
+3V3  (via drill 0.35, 0.35 pad 0.6, 0.4 pad 0.85, 0.8)
  Top 0.508: IC1.16 57.09,61.47 C1.1 58.42,62.04 58.98,61.47 58.98,57.78 v58.86,57.66 | IC1.5 46.41,56.39 v45.97,56.83 | R5.2 102.05,74.11 v102.87,74.93 | IC2.4 84.71,74.55 v83.82,73.66
  Top 0.813: IC9.14 54.61,72.39 53.47,72.39 v53.21,72.14 | R6.1 v46.99,81.28 | R7.1 43.56,82.49 v43.56,80.52 | R8.1 38.73,82.23 v38.73,80.01 | R10.2 69.72,75.95 v69.6,75.82 | OK2.8 42.55,62.87 v43.18,63.5 | 92.84,79.76 93.98,79.76 v95.89,81.66 | C3.1 91.95,80.64
  Top 0.889: C2.1 57.66,81.47 57.66,73.03 57.02,72.39 54.61,72.39 | IC2.8 92.46,78.36 92.84,78.74 92.84,79.76 91.95,80.64
  Top 1.016: v15.11,60.58 15.11,64.64 v17.78,67.31 | v74.93,85.09 v93.98,85.09 | v59.18,96.01 v54.1,101.09
  pour Route15 (rank 2): 0,104.14 165.1,104.14 167.64,101.6 167.64,0 1.27,0 0,-1.27
  pour Bottom (isolate 0.254, rank 4): 0.05,104.14 0.05,-1.27 170.18,-1.27 170.18,104.14
+12V  (via drill 0.35, 0.35 pad 0.75, 0.6, 0.65 pad 1.3, 0.8, 1.27, 1.27 pad 2.54)
  Top 0.889: D5.1 123.19,58.35 v123.19,55.88 | v76.58,68.83 78.49,68.83 80.01,67.31 v80.01,62.23 | v72.39,45.72 72.39,51.9 75.18,54.7 D8.C
  Top 1.016: R15.2 76.52,68.83 v76.58,68.83 | v25.65,51.56 27.43,53.34 31.75,53.34 v33.02,52.07
  Top 1.27: R20.1 100.56,48.83 D1.C 98.72,39.71 K2.4 | K6.1 30.48,45.38 D7.C 27.94,45.72 26.67,46.99 26.67,49.53 27.81,50.67 R14.2 | D2.1 v111.76,57.15 v100.33,57.15 96.88,57.15 95.77,58.26 91.28,58.26 90.17,57.15 90.17,46.99 v88.9,45.72
  Top 2.54: K7.1 72.39,38.1 v72.39,45.72
  pour Route15: 59.69,5.08 38.1,5.08 2.54,40.64 2.54,54.61 15.24,67.31 15.24,77.47 27.94,90.17 45.72,90.17 58.42,77.47 59.69,77.47 64.77,82.55 81.28,82.55 86.36,77.47 101.6,77.47 104.14,80.01 111.76,80.01 119.38,72.39 127,72.39 135.89,63.5 144.78,63.5 144.78,33.02 148.59,29.21 148.59,6.35 146.05,3.81 125.73,3.81 120.65,8.89 120.65,21.59 80.01,21.59 78.74,20.32 74.93,20.32
  pour Bottom: 21.59,40.64 21.59,33.02 29.21,25.4 31.75,25.4 36.83,30.48 36.83,34.29 38.1,35.56 38.1,45.72 39.37,46.99 40.64,46.99 58.42,29.21 67.31,29.21 73.66,35.56 99.06,35.56 106.68,27.94 110.49,27.94 114.3,31.75 114.3,38.1 133.35,57.15 133.35,60.96 129.54,64.77 78.74,64.77 77.47,66.04 77.47,72.39 72.39,72.39 69.85,69.85 69.85,53.34 68.58,52.07 55.88,52.07 54.61,53.34 48.26,46.99 45.72,46.99 43.18,49.53 40.64,49.53 36.83,53.34 13.97,53.34 7.62,46.99 7.62,41.91 13.97,41.91 15.24,40.64
AMS_LED-  (via drill 0.35 pad 0.65)
  Top 0.61: v20.32,57.15 20.83,57.66 27.94,57.66 29.72,55.88 35.56,55.88 38.1,58.42 v38.1,67.31 | v46.99,69.85 46.99,72.71 Q1.3
  Bottom 0.61: MISC_I/O.5 16.66,57.15 v20.32,57.15 | v38.1,67.31 40.64,69.85 v46.99,69.85
CAN1_H  (via drill 0.65 pad 1.3)
  Top 0.61: BMS_I/O.1 12.7,82.55 12.7,49.53 11.3,48.13 MISC_I/O.4
  Top 1.016: CAN1.3 153.67,55.01 153.67,71.12 | 153.67,73.66 161.29,81.28 v165.1,81.28 | 153.67,71.12 153.67,73.66 | R13.1 153.67,71.12 | R16.1 153.67,73.66
  Bottom 1.016: v165.1,81.28 165.1,85.34 148.72,101.73 58.8,101.73 52.32,95.25 50.49,95.25 50.33,95.41 40.8,95.41 31.75,86.36 BMS_I/O.1
CAN1_L  (via drill 0.8)
  Top 0.61: BMS_I/O.3 11.43,78.82 11.43,54.41 MISC_I/O.6
  Top 1.016: CAN1.5 162.56,64.3 162.56,71.12 | 162.56,71.12 162.56,73.66 | 162.56,73.66 v162.56,77.47 | R16.2 162.56,73.66 | R13.2 162.56,71.12
  Bottom 1.016: 52.07,88.9 49.53,88.9 41.99,81.36 BMS_I/O.3 | 60.45,99.82 147.83,99.82 162.56,85.09 v162.56,77.47
  Bottom 1.27: 52.07,88.9 55.88,92.71 55.88,95.25 60.45,99.82
CAN2_H  (via drill 0.35 pad 0.65, 0.35 pad 0.75)
  Top 0.508: v92.58,93.09 89.79,90.3 60.83,90.3 v50.93,100.2
  Top 0.61: v6.35,67.31 6.35,59.46 MISC_I/O.7 5.08,50.57 v5.08,30.48 | CAN2.3 138.98,26.52 R4.1 R1.1 120.8,26.52 v120.65,26.67
  Bottom 0.508: THERMAL_EX_I/0.3 119.46,93.96 118.17,92.67 106.14,92.67 105.72,93.09 v92.58,93.09 | v50.93,100.2 50.93,100.29 50.89,100.33 25.32,100.33 WIFI_MODULE.3
  Bottom 0.61: v6.35,67.31 6.35,71.32 BMS_I/O.6 | v120.65,26.67 120.65,21.59 113.03,13.97 106.68,13.97 95.25,2.54 33.02,2.54 v5.08,30.48
  Bottom 0.889: WIFI_MODULE.3 18.97,93.98 10.16,93.98 5.08,88.9 5.08,77.67 BMS_I/O.6
CAN2_L  (via drill 0.35 pad 0.65, 0.35 pad 0.75)
  Top 0.508: v92.71,95.25 88.9,91.44 60.96,91.44 v53.34,99.06
  Top 0.61: MISC_I/O.8 8.89,59.41 BMS_I/O.8 | CAN2.5 130.19,31.28 R4.2 R1.2 120.8,29.36 v120.65,29.21
  Top 0.889: v6.35,78.74 6.35,71.12 8.61,68.86 BMS_I/O.8
  Bottom 0.508: THERMAL_EX_I/0.5 113.18,95.25 v92.71,95.25 | v53.34,99.06 39.5,99.06 36.96,96.52 31.6,96.52 WIFI_MODULE.5
  Bottom 0.61: v120.65,29.21 111.58,20.14 110.64,20.14 94.31,3.81 34.29,3.81 3.81,34.29 3.81,51.79 MISC_I/O.8
  Bottom 0.889: WIFI_MODULE.5 22.33,92.33 10.74,92.33 6.35,87.94 v6.35,78.74
CHARGE_POWER
  Top 0.889: WIFI_MODULE.2 24.08,101.6 46.99,101.6 59.69,88.9 91.44,88.9 99.06,96.52 119.43,96.52 THERMAL_EX_I/0.2
  Top 1.27: F1.1 124.46,71.29 124.46,67.97 124.81,67.03 D5.2 128.58,67 130.81,64.77 130.81,62.23 134.62,58.42 BMS_POWER/GND.2
  Bottom 0.889: THERMAL_EX_I/0.2 121.97,92.2 126.87,87.3 F1.1
CHARGE_SAFE
  Top 0.508: TP3.TP 49.37,92.2 LED5.C 48.61,89.82 49.53,88.9 49.53,77.47 52.07,74.93 IC9.12
  Bottom 0.889: BMS_I/O.2 41.58,83.87 TP3.TP
CHASSIS_GND  (via drill 0.65 pad 1.3)
  Top 1.27: v86.36,7.62 90.17,3.81 116.84,3.81 120.65,7.62 126.92,7.62 ISOMETER_I/O.3
  Bottom 1.27: MISC_I/O.1 43.18,7.62 v86.36,7.62
DISCHARGE_ENABLE  (via drill 0.35)
  Top 0.508: TP7.TP 43.09,89.82 LED4.C 44.03,89.82 44.96,88.9 44.96,80.77 48.7,77.03 Q1.1 50.92,73.66 | 50.92,73.66 v53.34,73.66 IC9.13 | TP6.TP 56.71,50.48 R12.2 55.88,50.83 IC1.9 60.2,52.58 60.96,53.34 60.96,64.73 55.08,70.61 52.7,70.61 50.92,72.4 50.92,73.66 | IC9.6 IC9.5 v63.5,77.47
  Bottom 0.508: v63.5,77.47 57.15,77.47 v53.34,73.66
  Bottom 0.889: BMS_I/O.4 9.02,78.74 55.88,78.74 57.15,77.47
GND
  Top 0.889: C2.2 62.23,82.55 63.5,81.28 63.5,80.01 IC9.7 | C1.2 54.19,60.14 IC1.15 IC1.14 | IC1.12 IC1.11 52.07,55.12 51.94,54.99 51.94,53.34 51.18,52.58 IC1.8 | IC2.1 84.07,78.36 83.57,78.87 83.57,79.76 84.45,80.64
  pour Route2: 0,104.14 167.64,104.14 167.64,-1.27 0,-1.27
  pour Top (isolate 0.254): -1.27,105.41 171.45,105.41 171.45,-1.27 -1.27,-1.27
HIGHEST_TEMP
  Top 0.508: THERMAL_EX_I/0.4 113.16,90.17 TP9.TP
IMD_COIL_OUT
  Top 0.508: D8.A 76.45,64.01 TP14.TP
  Top 0.61: Q2.3 62.61,61.85 63.5,60.96 71.12,60.96 71.12,57.53 63.5,49.91 63.5,45.72 64.68,44.54 LED8.C 68.07,47.08 68.07,50.55 74.17,56.64 74.17,58.29 74.97,59.1 D8.A
  Top 1.016: K7.2 78.74,34.29 78.74,58.42 77.47,59.69 77.05,59.69 D8.A
IMD_LED-
  Top 0.61: MISC_I/O.3 17.78,53.26 17.78,60.96 26.67,69.85 35.56,69.85 37.97,72.26 Q3.3
LOWEST_TEMP
  Top 0.508: TP8.TP 102.87,91.44 109.42,91.44 THERMAL_EX_I/0.6
N$1  (via drill 0.35)
  Top 0.508: IC9.10 v53.34,77.47 | R2.1 48.64,64.81 48.64,66.04 v49.66,67.06 51.56,68.96 TP16.TP
  Bottom 0.508: v53.34,77.47 49.66,73.79 v49.66,67.06
N$2
  Top 1.27: F2.2 124.77,80.01 129.54,80.01 134.62,74.93 POWER/GND.2
N$3
  Top 2.54: K2.2 96.52,12.7 111.76,12.7 115.57,16.51 115.57,27.94 133.35,45.72 144.78,45.72 149.86,50.8 149.86,74.48 PRECHARGE/AIRS.1
N$4
  Top 1.27: F1.2 121.79,77.47 128.27,77.47 134.77,70.97 POWER/GND.1
N$5  (via drill 0.35 pad 0.75)
  Top 0.508: TP1.TP 39.37,90.17 LED6.C 40.19,89.82 41.29,88.72 41.29,81.54 40.13,80.39 v40.13,76.96 | IC1.4 45.97,57.66 43.31,60.33 OK2.6 39.75,60.33 39.24,60.83 v39.24,70.99
  Bottom 0.508: v40.13,76.96 39.24,76.07 v39.24,70.99
N$6
  Top 0.508: IC9.11 52.32,76.2 51.82,76.71 51.82,78.11 52.45,78.74 IC9.9 IC9.8 54.08,80.01 52.81,81.28 52.81,83.16 TP11.TP
N$7
  Top 0.508: OK2.3 30.55,60.33 R3.1
N$8
  Top 0.508: 64.77,67.25 R24.2 TP17.TP | 64.77,67.25 Q2.1 | 64.77,67.25 64.77,73.66 63.5,74.93 IC9.3
N$9  (via drill 0.35, 0.35 pad 0.6)
  Top 0.508: R25.2 | R25.2 Q3.1 | R25.2 43.5,75.75 44.2,75.06 v44.2,62.23 44.32,62.36 45.85,62.36 | IC9.2 62.74,73.66 63.12,73.28 63.12,72.64 62.87,72.39 IC9.1 61.49,70.1 v60.2,70.1 | v52.07,63.37 51.05,62.36 45.85,62.36 | IC1.2 46.23,60.2 45.85,60.58 45.85,62.36
  Bottom 0.508: TP5.TP 46.23,50.29 43.69,52.83 43.69,61.72 v44.2,62.23 | v52.07,63.37 57.02,63.37 58.27,64.62 58.27,69.32 59.05,70.1 v60.2,70.1
N$10  (via drill 0.35)
  Top 0.508: C9.1 R2.2 50.23,63.56 v49.91,63.25 | IC1.6 46.48,55.12 v45.72,55.88
  Top 0.61: C9.1 52.47,64.9 52.47,64.99 54.53,67.06 TP12.TP
  Bottom 0.508: v45.72,55.88 48.26,55.88 49.91,57.53 v49.91,63.25
N$11
  Top 2.54: K2.1 111.76,30.48 130.81,49.53 143.51,49.53 146.05,52.07 146.05,85.09 144.78,85.09 143.32,86.55 | 143.32,86.55 143.45,90.38 PRECHARGE/AIRS.5 | 143.32,86.55 129.49,100.38 68.63,100.38 66.45,98.2 EMSDC.5
N$12
  Bottom 2.54: PRECHARGE/AIRS.2 148.59,78.77 148.59,53.34 142.24,46.99 130.81,46.99 93.98,10.16 K2.3
N$14  (via drill 1 pad 2.54)
  Top 2.54: K7.4 64.77,19.05 71.12,19.05 85.09,33.02 v85.09,58.42
  Bottom 2.54: v85.09,58.42 87.63,60.96 95.25,60.96 99.06,64.77 99.06,68.58 87.63,80.01 82.55,80.01 78.33,84.23 EMSDC.2
N$15
  Top 0.889: TP21.TP 40.42,53.34 LED7.C 37.88,46.77 | 37.88,46.77 36.83,45.72 D7.A | Q4.3 38.93,45.72 | 38.93,45.72 37.88,46.77 | K6.2 38.93,33.46 38.93,45.72
N$16  (via drill 0.35)
  Top 0.508: Q4.1 R19.2 48.2,44.7 v52.07,44.7 | IC9.4 59.69,76.2 59.31,75.82 v59.31,68.83
  Bottom 0.508: v59.31,68.83 60.2,67.94 60.2,56.26 | 60.2,56.26 60.2,52.83 v52.07,44.7 | TP2.TP 60.2,56.26
N$17
  Top 0.508: IC2.6 92.2,75.82 92.46,76.07 | 92.46,76.07 92.46,76.71 92.08,77.09 IC2.7 | C7.1 R5.1 98.74,76.07 92.46,76.07
N$18
  Top 0.508: LED7.A 35.65,50.67 R14.1
N$19
  Bottom 2.54: EMSDC.3 EMSDC.4
N$20
  Top 0.61: R15.1 72.84,57.34 65.53,50.04 LED8.A
N$21
  Top 2.54: K6.4 31.75,11.43 72.39,11.43 K7.3
N$22
  Top 0.813: R20.2 102.56,50.67 LED1.A
N$25
  Top 0.508: LED4.A 43.05,84.9 R7.2
N$26
  Top 0.508: LED5.A R6.2
N$27
  Top 0.508: LED6.A R8.2
N$28
  Top 0.508: R10.1 C8.1 R11.2 78.17,79.31 80.39,77.09 IC2.2
N$32
  Top 0.508: IC2.5 90.68,74.49 C6.1
OK_HS  (via drill 0.65 pad 1.3)
  Top 0.508: OK2.2 32.89,61.59 31.24,63.25 TP10.TP
  Top 1.016: v118.11,10.16 93.98,10.16 91.06,13.08 v87,13.08 | v22.86,44.45 22.86,51.69 v27.05,55.88
  Bottom 1.016: ISOMETER_I/O.8 136.88,10.16 v118.11,10.16 | v87,13.08 42.8,13.08 34.29,21.59 34.29,36.83 26.67,44.45 v22.86,44.45 | v27.05,55.88 27.05,62.61 TP10.TP
PRECHARGE_EMSDC2
  Bottom 2.54: K6.3 52.07,26.67 100.33,26.67 104.29,30.63 104.29,69.7 99.69,74.3 82.29,91.7 EMSDC.1
PRECHARGE_SELECT
  Top 1.016: K2.5 94.32,33.95 D1.A 96.74,49.41 LED1.C 93.6,53.81 TP23.TP
  Bottom 0.889: BMS_I/O.7 38.33,41.91 87.63,41.91 97.79,31.75 K2.5
READY_POWER
  Top 0.889: WIFI_MODULE.1 21.59,96.52 50.22,96.52 59.11,87.63 112.98,87.63 F2.1
  Top 1.016: D2.2 111.76,81.87 F2.1 117.05,85.68 124.46,93.09 THERMAL_EX_I/0.1
  Top 1.27: BMS_POWER/GND.1 136.04,54.46 127,63.5 118.11,63.5 116.84,64.77 116.84,66.04 115.88,67 D2.2
STARTUP_RESET  (via drill 0.35)
  Top 0.508: IC1.3 49.66,58.93 50.04,58.55 50.04,54.48 49.4,53.85 IC1.7 | IC2.3 83.44,75.82 82.55,74.93 82.55,71.12 83.89,69.78 R9.2 86.43,69.78 87.5,68.71 87.5,67.06 88.9,65.66 TP4.TP
  Top 0.813: v45.97,59.31 46.35,58.93 IC1.3
  Bottom 0.813: TP4.TP 80.7,65.66 78.99,67.37 65.98,67.37 62.23,71.12 56.52,71.12 53.34,67.94 53.34,64.77 48.26,64.77 46.66,63.17 46.66,61.84 45.97,61.16 v45.97,59.31

### Text on the board
tValues: Designed by: Xianming Liu, James Willy, / Aminah Dixon, Omar Ahmed / Accumulator Mainboard V2
tDocu: LED6: IMD FAIL / LED4: DISCHARGE ENABLE / LED5: CHARGE SAFE